# EAGLE design Get_In_Line_REV1 (EAGLE 7.5.0)
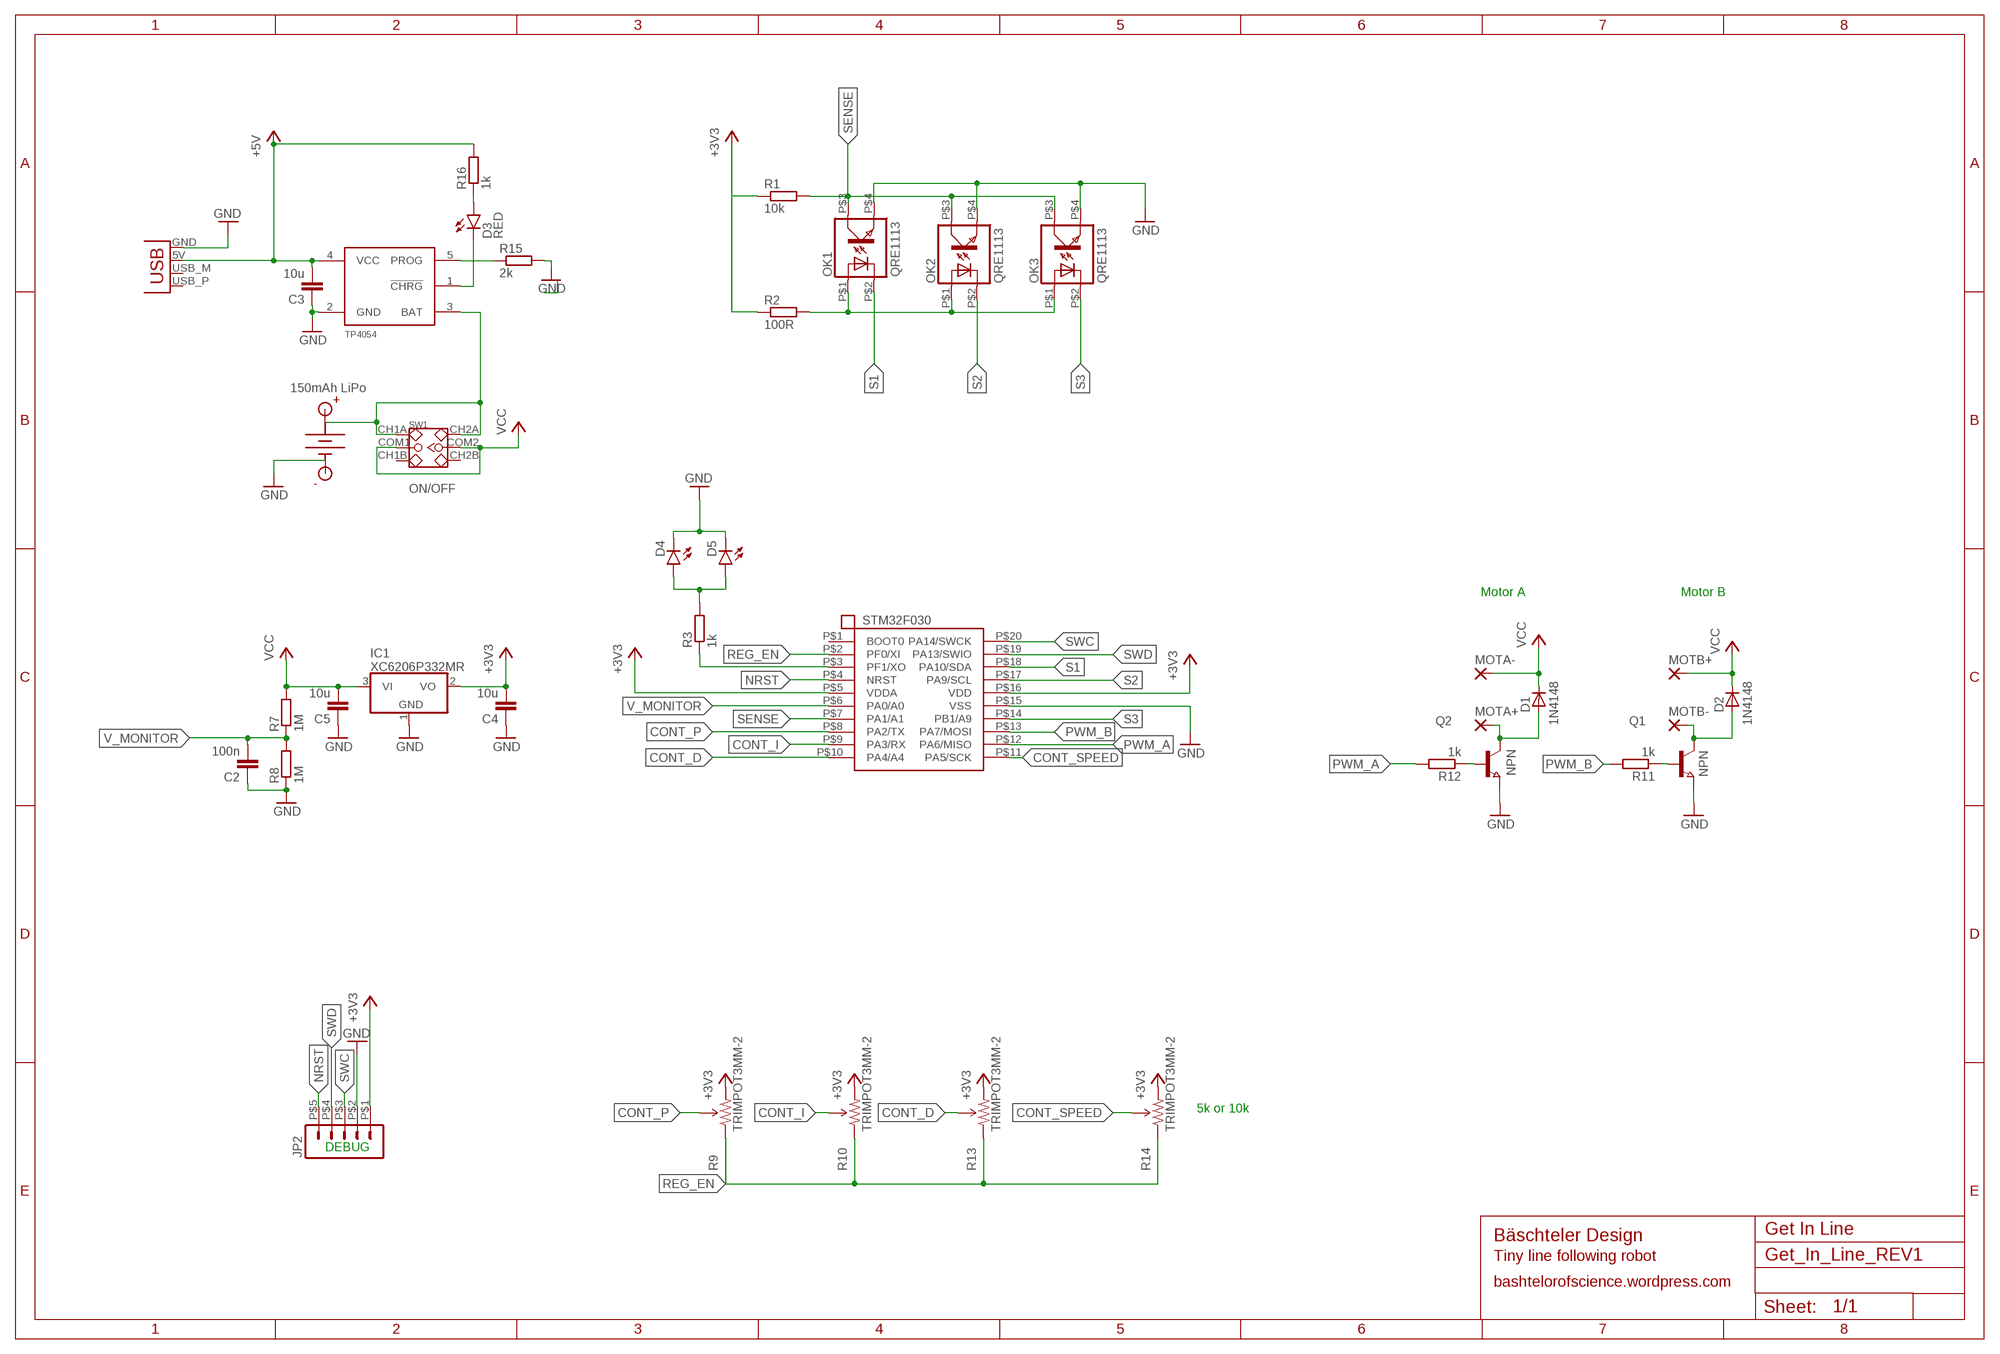
[diagram p0: schematic, sheet 1]

## Parts
C2  100n  C-EUC0805  [C0805]
C3  10u  C-EUC0805  [C0805]
C4  10u  C-EUC0805  [C0805]
C5  10u  C-EUC0805  [C0805]
D1  D-SOD-80  [SOD80]
D2  D-SOD-80  [SOD80]
D3  RED  LED-RED1206  [LED-1206]
D4  GREEN  LED-GREENLARGE  [LED-1206]
D5  GREEN  LED-GREENLARGE  [LED-1206]
IC1  MCP1703CB  [SOT23]
JP1  USBPCB  [USB-A-PCB]
JP2  M05  [SMD_HEADER_5P]
MCU  STM32F030F4P6  [TSSOP-20]
MOTA+  1,6/0,9  [1,6/0,9]
MOTA-  1,6/0,9  [1,6/0,9]
MOTB+  1,6/0,9  [1,6/0,9]
MOTB-  1,6/0,9  [1,6/0,9]
OK1  QRE1113  [DIL04]
OK2  QRE1113  [DIL04]
OK3  QRE1113  [DIL04]
Q1  NPN-TRANSISTOR_SOT23  [SOT23]
Q2  NPN-TRANSISTOR_SOT23  [SOT23]
R1  10k  R-EU_R0805  [R0805]
R2  100R  R-EU_R0805  [R0805]
R3  1k  R-EU_R0805  [R0805]
R7  1M  R-EU_R0805  [R0805]
R8  1M  R-EU_R0805  [R0805]
R9  TRIMPOT3MM-2  [TRIMPOT-3MM-2]
R10  TRIMPOT3MM-2  [TRIMPOT-3MM-2]
R11  1k  R-EU_R0805  [R0805]
R12  1k  R-EU_R0805  [R0805]
R13  TRIMPOT3MM-2  [TRIMPOT-3MM-2]
R14  TRIMPOT3MM-2  [TRIMPOT-3MM-2]
R15  2k  R-EU_R0805  [R0805]
R16  1k  R-EU_R0805  [R0805]
SW1  DIP-TOGGLE-SWITCH-2CH-(2X3P-2.54)  [SW6-2.54-9.0X3.5X3.2+2.0MM]
U$1  TP4054_LIPO_CHARGER  [SOT23-5]
U$5  BATTERY_PAD+1.5MM  [LIPO_BATTERY_PADS_1.5MM]
U$6  BATTERY_PAD-1.5MM  [LIPO_BATTERY_PADS_1.5MM]

## Nets
+3V3: C4.2 IC1.2(VO) JP2.P$1 MCU.P$5(VDDA) MCU.P$16(VDD) R1.1 R2.1 R9.3(CW) R10.3(CW) R13.3(CW) R14.3(CW)
+5V: C3.2 JP1.5V(VBUS) R16.2 U$1.4(VCC)
CONT_D: MCU.P$10(PA4/A4) R13.2(WIPER)
CONT_I: MCU.P$9(PA3/RX) R10.2(WIPER)
CONT_P: MCU.P$8(PA2/TX) R9.2(WIPER)
CONT_SPEED: MCU.P$11(PA5/SCK) R14.2(WIPER)
GND: C2.1 C3.1 C4.1 C5.1 D4.C D5.C IC1.1(GND) JP1.GND JP2.P$2 MCU.P$15(VSS) OK1.P$4(EMIT) OK2.P$4(EMIT) OK3.P$4(EMIT) Q1.2(E) Q2.2(E) R8.1 R15.2 U$1.2(GND) U$6.P$1
LED: MCU.P$3(PF1/XO) R3.1
LEDOUT: D4.A D5.A R3.2
N$1: OK1.P$1(A) OK2.P$1(A) OK3.P$1(A) R2.2
N$5: R15.1 U$1.5(PROG)
N$6: D3.C U$1.1(!CHRG)
N$7: D3.A R16.1
N$9: Q1.1(B) R11.1
N$10: Q2.1(B) R12.1
N$13: D1.2(A) MOTA+.1(P) Q2.3(C)
N$14: D2.2(A) MOTB-.1(P) Q1.3(C)
NRST: JP2.P$5 MCU.P$4(NRST)
PWM_A: MCU.P$12(PA6/MISO) R12.2
PWM_B: MCU.P$13(PA7/MOSI) R11.2
REG_EN: MCU.P$2(PF0/XI) R9.1(CCW) R10.1(CCW) R13.1(CCW) R14.1(CCW)
S1: MCU.P$18(PA10/SDA) OK1.P$2(C)
S2: MCU.P$17(PA9/SCL) OK2.P$2(C)
S3: MCU.P$14(PB1/A9) OK3.P$2(C)
SENSE: MCU.P$7(PA1/A1) OK1.P$3(COL) OK2.P$3(COL) OK3.P$3(COL) R1.2
SWC: JP2.P$3 MCU.P$20(PA14/SWCK)
SWD: JP2.P$4 MCU.P$19(PA13/SWIO)
V_MONITOR: C2.2 MCU.P$6(PA0/A0) R7.1 R8.2
VBAT: SW1.CH1A SW1.CH2A U$1.3(BAT) U$5.P$1
VCC: C5.2 D1.1(C) D2.1(C) IC1.3(VI) MOTA-.1(P) MOTB+.1(P) R7.2 SW1.COM1 SW1.COM2
Unconnected: JP1.USB_M(D-) JP1.USB_P(D+) MCU.P$1(BOOT0) SW1.CH1B SW1.CH2B

## Notes on the sheet
- 150mAh LiPo
- ON/OFF
- Motor A | Motor B
- STM32F030
- XC6206P332MR
- 1N4148 | 1N4148
- NPN | NPN
- 5k or 10k
- DEBUG
- Get In Line
- Bäschteler Design
- Tiny line following robot
- bashtelorofscience.wordpress.com

## Library data of the parts
C2-C5 = resistor:C-EU: CAPACITOR, European symbol
D1 D2 = semicon-smd-ipc:D-: DIODE unfilled
D3 = SparkFun-LED:LED-RED: Assorted Red LEDs LilyPad 1206- DIO-09912 1206- DIO-00809 0603- DIO-00819; PROD_ID: DIO-00809
D4 D5 = SparkFun-LED:LED-GREEN: Various green LEDs Green LEDs used in SFE Production 0603- DIO-00821 LARGE- DIO-00862 LILYPAD- DIO-09910; PROD_ID: DIO-00862
IC1 = linear:MCP1703: 250 mA, 16V, Low Quiescent Current LDO Regulator Source: http://ww1.microchip.com/downloads/en/DeviceDoc/22049b.pdf
JP1 = SparkFun-Connectors:USB: USB Connectors USB-B-PTH is fully proven SKU : PRT-00139/CONN-08278 USB-miniB is fully proven SKU : PRT-00587 USB-A-PCB is untested. USB-A-H is throughly reviewed, but untested. Spark Fun Electronics SKU : PRT-00437 USB-B-SMT is throughly reviewed, but untested. Needs silkscreen touching up. USB-A-S has not been used/tested USB-MB-H has not been used/tested USB-MICROB has been used. CONN-09505
JP2 = smd_pinheader:M05: Header 5 Standard 5-pin 0.1" header. Use with straight break away headers (SKU : PRT-00116), right angle break away headers (PRT-00553), swiss pins (PRT-00743), machine pins (PRT-00117), and female headers (PRT-00115). Molex polarized connector foot print use with SKU : PRT-08230 with associated crimp pins and housings.
MCU = pulseoxparts:STM32F030F4P6
MOTA+ MOTA- MOTB+ MOTB- = wirepad:1,6/0,9: THROUGH-HOLE PAD
OK1-OK3 = fairchild_optosensor:QRE1113: FAIRCHILD REFLECTIVE SENSOR
Q1 Q2 = semicon-smd-ipc:NPN-TRANSISTOR_: NPN TRANSISTOR
R1-R3 R7 R8 R11 R12 R15 R16 = resistor:R-EU_: RESISTOR, European symbol
R9 R10 R13 R14 = SparkFun-Electromechanical:TRIMPOT: Various small potentiometers for "set-and-forget" applications
SW1 = Seeed-Switch-2016:DIP-TOGGLE-SWITCH-2CH-(2X3P-2.54): 311010004; MPN: MS-22D18 G2 ROHS
U$1 = TP4054_lipocharger:TP4054_LIPO_CHARGER
U$5 = LiPo_Battery:BATTERY_PAD+
U$6 = LiPo_Battery:BATTERY_PAD-

## Board
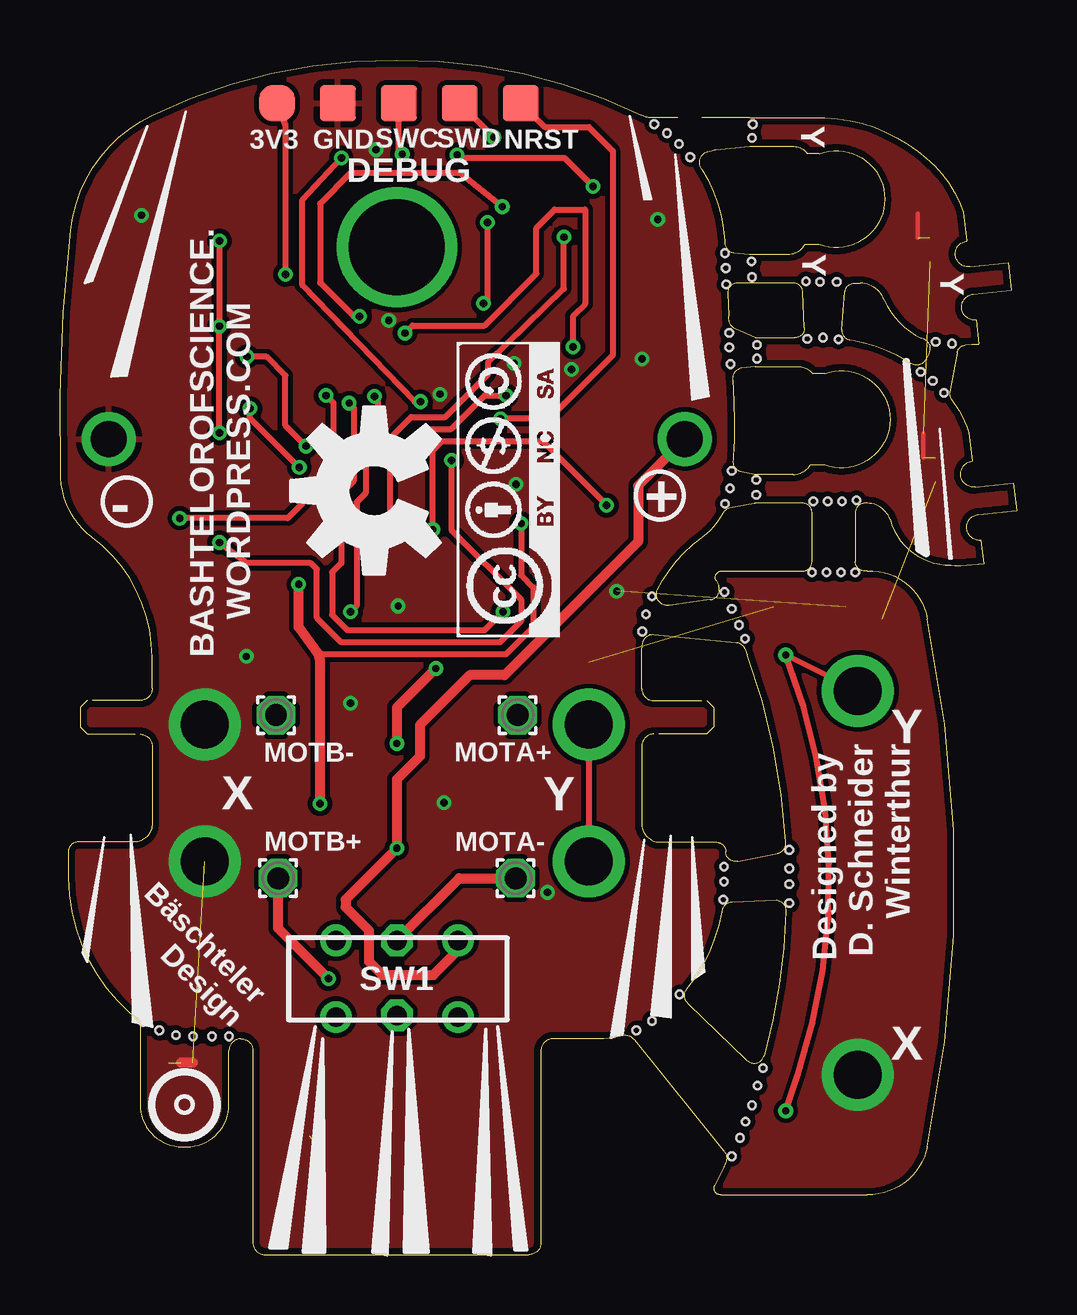
[diagram p1: board, top side]
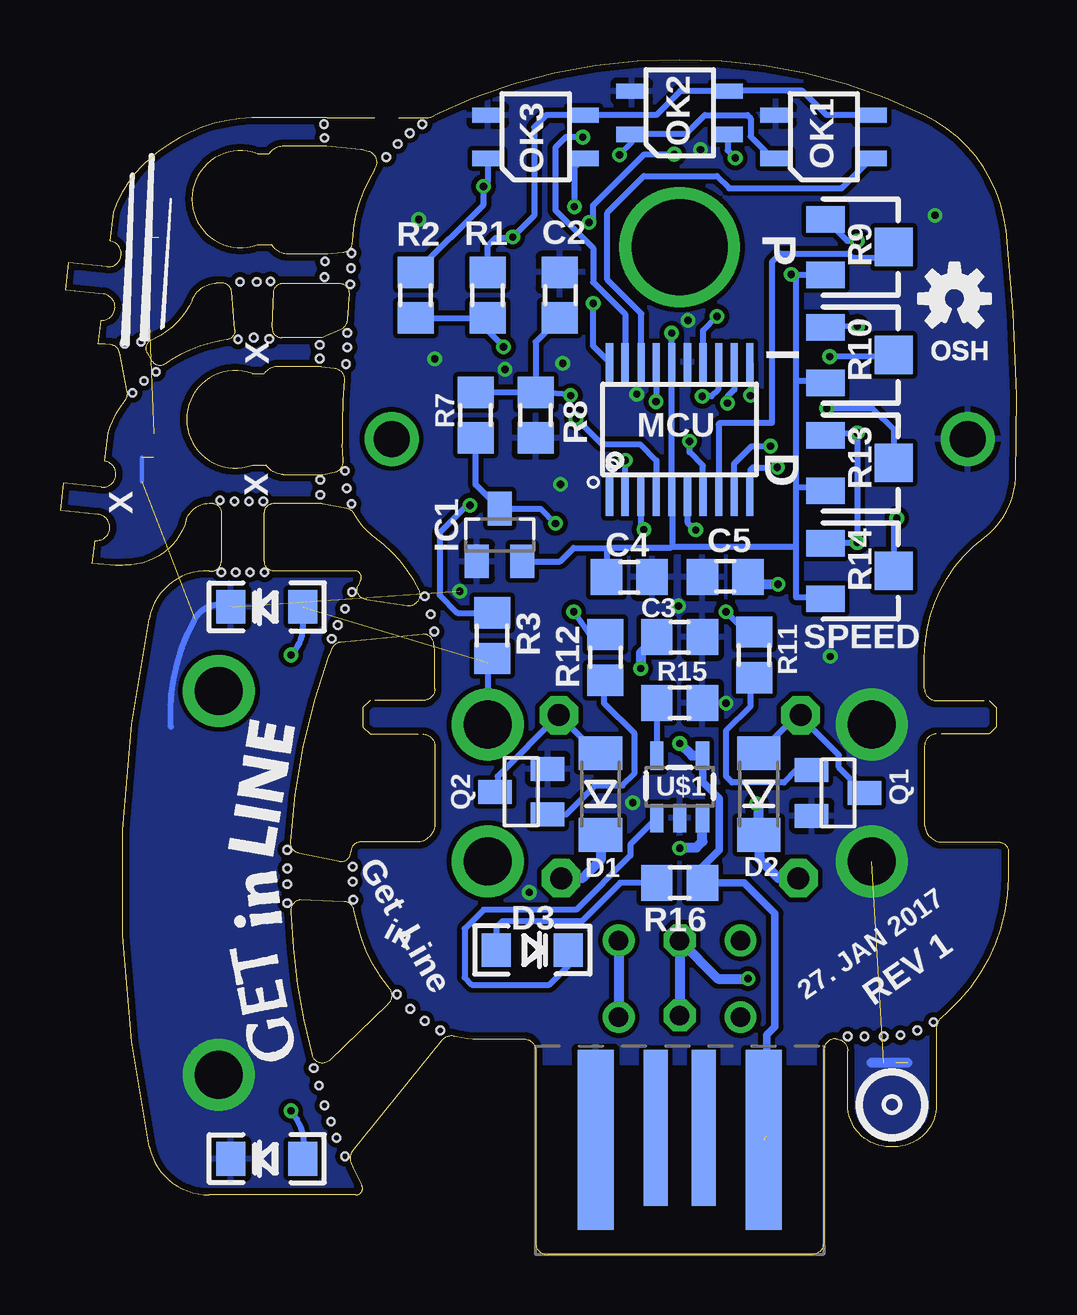
[diagram p2: board, bottom side, seen from below]

Size 39.86 x 49.8 mm. Coordinates in mm from the lower left corner, seen from the top.
Outline: 0.04,32.4 arc51 1.34,29.9 arc-53 3.84,24.9 3.84,23.6 arc-90 3.34,23.1 1.14,23.1 0.84,22.8 0.84,22 1.14,21.7 3.34,21.7 arc-90 3.84,21.2 3.84,17.92 arc-90 3.02,17.2 0.75,17.2 arc90 0.34,16.79 0.34,15.7 arc47 2.89,10.1 3.17,9.85 arc-48 3.34,9.47 3.34,6.25 arc90 5.09,4.5 5.29,4.5 arc90 7.04,6.25 7.04,8.5 arc-90 7.54,9 arc-90 8.04,8.5 8.04,0.5 arc90 8.54,0 19.54,0 arc90 20.04,0.5 20.04,8.5 arc-90 20.54,9 22.44,9 arc16 23.34,9.1 23.43,9.12 arc-65 23.94,8.95 27.67,4.3 arc-61 27.74,3.86 27.64,3.6 27.29,2.9 arc127 27.54,2.5 33.64,2.5 arc79 36.14,4.5 arc24 36.14,26.5 arc83 33.64,28.5 33.54,28.5 arc-90 33.14,28.9 33.14,30.93 arc-90 33.54,31.32 33.64,31.32 arc-69 34.59,30.65 arc76 37.14,28.75 arc8 37.54,28.73 38.51,28.8 38.39,29.77 arc-180 38.27,30.86 39.86,31.02 39.72,32.16 38.13,32 arc-180 38.01,33.08 37.86,34.27 arc17 37.44,35.2 37.13,35.66 arc-44 37.07,35.96 37.38,37.6 arc-74 37.74,37.93 37.99,37.95 38.29,37.95 38.17,38.96 arc-180 38.05,40.04 39.64,40.2 39.5,41.34 37.91,41.18 arc-180 37.79,42.26 37.64,43.46 arc35 35.74,46 arc15 33.94,47 arc22 31.34,47.4 28.74,47.4 24.56,47.4 arc-33 24.24,47.5 arc27 14.04,49.8
Outline: 0.04,32.4 arc-9 0.44,42.7
Outline: 0.44,42.7 arc-57 3.84,47.5
Outline: 3.84,47.5 arc-27 14.04,49.8
Outline: 28.64,25 28.54,25.26 arc63 28.18,25.52 24.74,25.86 arc88 24.29,25.5 arc13 24.24,24.9 24.24,23.6 arc90 24.74,23.1 26.94,23.1 27.24,22.8 27.24,22 26.94,21.7 24.74,21.7 arc90 24.24,21.2 24.24,17.92 arc90 25.06,17.2 27.33,17.2 arc-90 27.74,16.8 arc101 28.23,16.4 29.9,16.73
Outline: 29.9,16.73 arc79 30.24,17.15
Outline: 29.84,14.79 28.01,14.71 arc74 27.61,14.39 27.59,14.3 arc-29 26.14,11.1 26.11,11.06 arc87 26.19,10.46 28.62,8.11 arc118 29.34,8.3
Outline: 29.84,14.79 arc-92 30.24,14.3
Outline: 30.24,14.3 arc-14 29.34,8.3
Outline: 30.24,17.2 arc17 28.64,25
Outline: 29.9,16.73 arc79 30.24,17.15
Outline: 29.84,14.79 arc-92 30.24,14.3
Outline: 30.24,14.3 arc-14 29.34,8.3
Outline: 30.24,17.2 arc17 28.64,25
Outline: 29.9,16.73 arc79 30.24,17.15
Outline: 30.24,17.15 30.24,17.2
Outline: 29.84,14.79 arc-92 30.24,14.3
Outline: 30.24,14.3 arc-14 29.34,8.3
Outline: 30.24,17.2 arc17 28.64,25
Outline: 0.04,32.4 arc-9 0.44,42.7
Outline: 0.44,42.7 arc-57 3.84,47.5
Outline: 0.04,32.4 arc-9 0.44,42.7
Outline: 0.44,42.7 arc-57 3.84,47.5
Outline: 3.84,47.5 arc-27 14.04,49.8
Outline: 0.04,32.4 arc-9 0.44,42.7
Outline: 0.44,42.7 arc-57 3.84,47.5
Outline: 0.04,32.4 arc-9 0.44,42.7
Outline: 0.44,42.7 arc-57 3.84,47.5
Outline: 3.84,47.5 arc-27 14.04,49.8
Outline: 0.04,32.4 arc-9 0.44,42.7
Outline: 0.44,42.7 arc-57 3.84,47.5
Outline: 0.04,32.4 arc-9 0.44,42.7
Outline: 0.44,42.7 arc-57 3.84,47.5
Outline: 3.84,47.5 arc-27 14.04,49.8
Outline: 0.04,32.4 arc-9 0.44,42.7
Outline: 0.44,42.7 arc-57 3.84,47.5
Outline: 27.54,28.5 30.94,28.5 arc90 31.34,28.9 31.34,30.93 arc90 30.94,31.32 28.99,31.32 arc11 28.92,31.31 27.91,31.11 arc49 27.61,30.9 27.51,30.73 arc-21 26.74,29.9 arc27 24.89,27.7 arc120 25.39,27.06 27.09,27.3 arc110 27.44,27.9 27.34,28.1 arc-113 27.54,28.5
Outline: 28.96,37.02 30.76,37.02 arc-56 31.36,36.72 31.86,36.72 arc-220 31.86,32.92 31.26,32.92 arc-56 30.56,32.52 29,32.52 arc-11 28.92,32.53 28.41,32.63 arc-82 28.06,33.08 28.06,33.12 28.09,33.8 arc5 28.02,36.47 arc-87 28.41,36.95 28.96,37.02
Outline: 28.74,46.2 30.54,46.2 arc-56 31.14,45.9 31.64,45.9 arc-220 31.64,42.1 31.04,42.1 arc-56 30.34,41.7 28.76,41.7 arc-6 28.72,41.7 28.08,41.77 arc-78 27.7,42.14 27.69,42.25 arc30 26.74,45.25 arc-111 26.99,45.98 27.16,46.03 arc-10 27.32,46.06 28.74,46.2
Outline: 34.34,39.8 arc69 33.34,40.5 33.11,40.5 arc85 32.71,40.13 32.57,38.57 arc86 32.9,38.14 33.14,38.1 arc-19 35.24,37.3 35.47,37.14 arc95 36.05,37.28 36.22,37.59 arc99 36,38.16 35.89,38.2 arc-40 34.34,39.8
Outline: 30.56,40.5 28.24,40.5 arc93 27.82,40.05 27.84,39.65 27.86,39.12 27.87,38.99 arc63 28.15,38.58 28.96,38.23 30.62,38.23 arc93 31.02,38.64 30.96,40.12 arc87 30.56,40.5
Copper layers (1*16): Top 0.035mm / dielectric 1.5mm / Bottom 0.035mm
Design rules "dirt_cheap_dirty_boards.v1": minimum track width 5mil, minimum drill 12mil, track to track 5mil, track to pad 5mil, pad to pad 5mil, via to via 5mil, smd to smd 0mil, copper to edge 10mil, drill to drill 10mil, minimum pad ring 10mil, minimum via ring 6mil, stop-mask expansion 2mil, vias tented up to drill 25mil, thermal gap 10mil
Holes 0.3 mm at 27.66,16.18 27.66,15.55 27.64,14.8 24.01,9.35 24.66,9.75 25.26,10.25 25.81,10.85 29.29,7.78 29.06,7.05 28.84,6.22 28.56,5.55 28.34,4.88 27.99,4.1 30.39,16.88 30.39,16.1 30.39,15.45 30.39,14.65 24.66,27.45 24.41,26.7 24.26,25.98 27.69,27.62 27.99,26.93 28.29,26.25 28.54,25.68 27.71,31.3 27.91,31.95 27.99,32.67 29.01,32.3 29.01,31.68 27.89,38.42 27.89,37.83 27.94,37.12 29.04,37.92 29.04,37.35 35.86,36.8 36.36,36.42 36.84,35.92 36.49,38.05 37.16,37.98 32.44,38.15 31.79,38.23 31.14,38.17 31.09,40.58 31.66,40.55 32.36,40.55 27.71,41.75 27.74,41.12 27.76,40.45 28.81,41.4 28.84,40.75 28.86,47.12 28.84,46.55 24.76,47.12 25.29,46.75 25.79,46.3 26.26,45.75 31.39,31.4 31.99,31.4 32.59,31.4 33.19,31.45 31.34,28.45 31.94,28.45 32.54,28.45 33.14,28.45 3.46,9.7 7.04,9.1 6.34,9.1 5.54,9.1 4.84,9.15 4.14,9.35

### Footprints (pad centres in the part's own frame; a part is rotated, then mirrored left to right if it is on the bottom)
C0805 = smd 1.3 x 1.5: 1 -0.95,0; 2 0.95,0
SOD80 = smd 1.4 x 1.8: 1 -1.7,0; 2 1.7,0
LED-1206 = smd 1.2 x 1.4: A -1.5,0; C 1.5,0
SOT23 = smd 1 x 1.4: 1 -0.95,-1.1; 2 0.95,-1.1; 3 0,1.1
USB-A-PCB = smd 7.5 x 1.5: 5V -0.2,-3.5; GND -0.2,3.5 | smd 6.5 x 1: USB_M 0.3,-1; USB_P 0.3,1
SMD_HEADER_5P = smd 1.5 x 1.5: P$1 0,0; P$2 2.54,0; P$3 5.08,0; P$4 7.62,0; P$5 10.16,0
TSSOP-20 = smd 1.6 x 0.3: P$1 -2.8,2.925; P$2 -2.8,2.275; P$3 -2.8,1.625; P$4 -2.8,0.975; P$5 -2.8,0.325; P$6 -2.8,-0.325; P$7 -2.8,-0.975; P$8 -2.8,-1.625; P$9 -2.8,-2.275; P$10 -2.8,-2.925; P$11 2.8,-2.925; P$12 2.8,-2.275; P$13 2.8,-1.625; P$14 2.8,-0.975; P$15 2.8,-0.325; P$16 2.8,0.325; P$17 2.8,0.975; P$18 2.8,1.6; P$19 2.8,2.275; P$20 2.8,2.925
1,6/0,9 = drill 0.914 pad 1.6 octagon: 1 0,0
DIL04 = smd 0.635 x 1.27: P$1 0.3,-2; P$2 0.3,2; P$3 -1.5,2; P$4 -1.5,-2
R0805 = smd 1.3 x 1.5: 1 -0.95,0; 2 0.95,0
TRIMPOT-3MM-2 = smd 1.092 x 1.6: 1 -1.155,-1.421; 3 1.155,-1.421 | smd 1.6 x 1.6: 2 0,1.421
SW6-2.54-9.0X3.5X3.2+2.0MM = drill 0.813 pad 1.27: CH1A -2.54,-1.6; CH1B 2.54,-1.6; CH2A -2.54,1.6; CH2B 2.54,1.6 | drill 0.813 pad 1.27 octagon: COM1 0,-1.6; COM2 0,1.524
SOT23-5 = smd 0.55 x 1.2: 1 -0.95,-1.3; 2 0,-1.3; 3 0.95,-1.3; 4 0.95,1.3; 5 -0.95,1.3
LIPO_BATTERY_PADS_1.5MM = drill 1.5: P$1 0,0

### Placement (x,y rotation side)
C2  19.04,40 270 bottom
C3  14.04,25.75 180 bottom
C4  16.14,28.25 180 bottom
C5  12.14,28.25 0 bottom
D1  17.34,19.2 90 bottom
D2  10.74,19.2 90 bottom
D3  20.18,12.7 0 bottom
D4  31.24,27 180 bottom
D5  31.24,4 180 bottom
IC1  21.54,30 0 bottom
JP1  14.04,5 90 bottom
JP2  9.04,48 0 top
MCU  14.04,34.4 90 bottom
MOTA+  19.07,22.49 0 top
MOTA-  18.98,15.69 0 top
MOTB+  9.09,15.69 0 top
MOTB-  9,22.49 0 top
OK1  8.04,46 270 bottom
OK2  14.04,47 270 bottom
OK3  20.04,46 270 bottom
Q1  7.44,19.25 270 bottom
Q2  20.64,19.3 90 bottom
R1  22.04,40 90 bottom
R2  25.04,40 90 bottom
R3  21.86,25.81 270 bottom
R7  22.54,35 270 bottom
R8  20.04,35 90 bottom
R9  6.54,42 270 bottom
R10  6.54,37.5 270 bottom
R11  10.94,25 90 bottom
R12  17.14,24.9 90 bottom
R13  6.54,33 270 bottom
R14  6.54,28.5 270 bottom
R15  14.04,23 0 bottom
R16  14.04,15.5 0 bottom
SW1  14.04,11.5 180 top
U$1  14.04,19.5 0 bottom
U$2  [OSHW-LOGO-S]  2.59,39.85 0 bottom
U$4  [CC-BY-NC-SA]  20.81,25.76 90 top
U$5  26.04,34 0 top
U$6  2.04,34 0 top
U$8  [OSHW-LOGO-S]  2.59,39.85 0 bottom
U$9  [OSHW-LOGO-S]  2.59,39.85 0 bottom
U$10  [OSHW-LOGO-S]  2.59,39.85 0 bottom
U$13  [OSHW-LOGO-S]  2.59,39.85 0 bottom
U$14  [OSHW-LOGO-S]  2.59,39.85 0 bottom
U$15  [OSHW-LOGO-S]  2.59,39.85 0 bottom
U$16  [OSHW-LOGO-S]  2.59,39.85 0 bottom
U$33  [OSHW-LOGO-L]  13.09,31.85 90 top

### Tracks (layer width: path | path; a pad name or v marks a point on that pad's centre or on a via)
+3V3  (via drill 0.3)
  Top 0.254: v14.37,38.41 14.69,38.73 17.69,38.73 19.85,40.89 19.85,42.8 20.61,43.56 21.88,43.56 21.88,39.62 21.37,39.12 v21.37,37.85 | JP2.P$1 9.38,47.09 v9.39,40.87
  Bottom 0.254: v14.37,38.41 14.36,38.2 MCU.P$16 MCU.P$5 14.36,29.52 | C4.2 17.06,28.03 17.06,29.46 | R13.3 8.09,31.97 9.18,31.97 | 9.18,31.97 9.18,36.42 | 9.18,36.42 9.18,40.86 | 9.18,40.86 9.17,40.84 R9.3 | R10.3 8.03,36.42 9.18,36.42 | R14.3 8.01,27.4 9.18,27.4 9.18,29.54 | 9.18,29.54 9.18,31.97 | 17.06,29.46 14.41,29.46 14.36,29.52 | IC1.2 19.02,28.9 18.45,29.46 17.06,29.46 | v9.39,40.87 v9.39,40.86 9.18,40.86 | v21.37,37.85 22.04,38.51 R1.1 R2.1 | 14.36,29.52 9.21,29.52 9.18,29.54
+5V  (via drill 0.3)  (1 unrouted)
  Top 0.406: v15.66,24.43 14.03,22.81 v14.03,21.31
  Bottom 0.305: U$1.4 13.07,20.78 13.07,19.71 12.38,19.02 12.38,16.87 13.09,16.16 R16.2 11.35,15.5 10.07,14.22 10.07,9.5 10.4,9.17 10.4,4.94
  Bottom 0.406: C3.2 15.66,25.08 v15.66,24.43 | v14.03,21.31 13.52,20.8 U$1.4
CONT_D  (via drill 0.3)
  Top 0.254: v9.97,32.82 7.91,34.87 v7.91,35.27
  Bottom 0.254: R13.2 5.12,34.38 6.01,35.27 v7.91,35.27 | MCU.P$10 11.09,31.63 11.09,32.72 10.99,32.82 v9.97,32.82
CONT_I  (via drill 0.3)
  Top 0.254: v10.25,33.71 9.39,34.57 9.39,36.65 8.6,37.43 v7.79,37.43
  Bottom 0.254: R10.2 5.18,37.43 v7.79,37.43 | MCU.P$9 11.77,31.61 11.77,32.97 11.04,33.71 v10.25,33.71
CONT_P
  Bottom 0.254: MCU.P$8 12.41,34.62 12.36,34.67 10.2,34.67 10.2,41.38 9.84,41.73 7.02,41.73 6.85,41.55 5.56,41.55 R9.2
CONT_SPEED  (via drill 0.3)
  Top 0.254: v11.09,35.81 11.39,35.51 11.39,32.61 9.48,30.7 v4.99,30.7
  Bottom 0.254: MCU.P$11 11.09,37.17 v11.09,35.81 | v4.99,30.7 5.12,30.58 R14.2
GND  (via drill 0.3, 2)  (7 unrouted)
  Top 0.178: 35.96,34.22 35.96,33.22 | 35.74,43.4 35.74,42.4
  Top 0.406: 5.54,8 5.04,8
  Bottom 0.178: 36.46,32.22 36.46,33.22 | 36.24,41.4 36.24,42.4
  Bottom 0.254: 35.24,22 arc32 34.24,26.5 arc86 D4.C
  Bottom 0.406: 4.54,8 6.04,8
  other vias: 13.7,38.95 12.1,22.99 6.04,22.1 6.04,16.4 20.31,15.1 24.91,43.15 33.24,7.5 18.91,37.16 24.24,37.34 21.32,36.91 19,32.11 23.2,27.66 14.09,27.04 13.17,46.06 15.83,35.87 3.4,43.33 7.76,24.94 15.99,18.84
  pour Bottom (isolate 0.2): 0.04,50 0.04,8 3.04,8 3.04,4.5 7.04,4.5 7.04,8 26.04,8 26.04,2 41.04,2 41.04,50
  pour Top (isolate 0.2): 0.04,50 0.04,0 41.04,0 41.04,50
LED  (via drill 0.3)
  Top 0.254: v15.53,30.23 15.53,33.53 15.91,33.91 20.1,33.91 v22.77,31.24
  Bottom 0.254: MCU.P$3 15.66,30.36 v15.53,30.23 | v22.77,31.24 22.9,31.24 24.04,30.1 24.04,27.5 23.3,26.76 R3.1
LEDOUT  (via drill 0.3, 2)  (1 unrouted)
  Top 0.254: v30.24,6 30.74,7.5 arc40 v30.24,25 v33.24,23.5 | v22.04,22.1 v22.04,16.4
  Bottom 0.254: v30.24,25 arc-74 29.92,26.96 arc21 D4.A | D5.A arc-53 v30.24,6 | R3.2 22.04,24.68 v22.04,22.1
N$1  (via drill 0.3)
  Top 0.254: v16.55,45.85 16.68,45.72 21.02,45.72 v22.21,44.53 22.04,44.7
  Bottom 0.254: v16.55,45.85 16.04,46.36 OK2.P$1 16,46.74 13.75,46.74 12.99,47.5 11.21,47.5 11.09,47.37 11.09,46.61 10.18,45.7 OK1.P$1 | R2.2 22.21,43.78 v22.21,44.53 22.04,44.7 OK3.P$1
N$5
  Bottom 0.254: R15.1 14.99,22.9 U$1.5
N$6
  Bottom 0.254: U$1.1 16.09,17.1 16.09,16.64 18.35,14.38 22.21,14.38 23,13.59 23,11.56 22.7,11.25 19.47,11.25 18.68,12.04 D3.C
N$7
  Bottom 0.254: R16.1 16.52,15.5 18.12,13.89 21.43,13.89 21.68,13.64 D3.A
N$8  (via drill 4)
  other vias: 14.04,42
N$9
  Bottom 0.254: Q1.1 9.18,20.2 9.69,19.68 11.85,19.68 12.1,19.94 12.1,21.84 11.09,22.86 11.09,24 R11.1
N$10
  Bottom 0.254: Q2.1 18.77,18.35 17.56,19.56 16.42,19.56 15.91,20.07 15.91,21.72 17.18,22.99 17.18,24 R12.1
N$13
  Bottom 0.254: Q2.3 21.63,19.41 21.63,19.94 MOTA+.1 17.48,20.9 D1.2
N$14
  Bottom 0.254: Q1.3 7.4,20.32 7.4,20.83 9,22.42 MOTB-.1 9.14,22.49 D2.2
NRST  (via drill 0.3)
  Top 0.254: JP2.P$5 20.2,47 22.04,47 23.04,46 23.04,37.5 20.39,34.85 v18.35,34.85
  Bottom 0.254: v18.35,34.85 17.29,33.78 15.68,33.78 15.01,33.11 MCU.P$4
PWM_A  (via drill 0.3)
  Top 0.254: v12.05,35.5 12.23,35.32 12.23,32.26 11.72,31.75 11.72,28.83 11.34,28.45 11.34,26.67 11.98,26.04 17.69,26.04 v18.45,26.8
  Bottom 0.254: MCU.P$12 11.76,36.06 12.05,35.77 v12.05,35.5 | v18.45,26.8 17.72,25.75 R12.2
PWM_B  (via drill 0.3)
  Top 0.254: v13.1,35.78 13.25,35.63 13.25,34.8 12.74,34.29 12.74,31.75 12.36,31.37 12.36,27.05 v12.1,26.8
  Bottom 0.254: MCU.P$13 12.44,37.17 12.44,36.06 12.72,35.78 v13.1,35.78 | v12.1,26.8 11.16,25.85 R11.2
REG_EN  (via drill 0.3)
  Top 0.254: v6.64,42.26 v6.64,38.7 v6.64,34.26 | v16.31,33.11 16.31,30.21 19.22,27.3 19.22,26.42 18.33,25.53 11.72,25.53 10.71,26.54 10.71,28.57 10.45,28.83 7.79,28.83 v6.64,29.69
  Bottom 0.254: R9.1 7.06,42.26 v6.64,42.26 | v6.64,38.7 7.86,38.66 R10.1 | R13.1 7.86,34.26 v6.64,34.26 v6.64,29.69 7.93,29.69 R14.1 | MCU.P$2 v16.31,33.11
S1
  Bottom 0.254: MCU.P$18 15.64,39.22 17.06,40.64 17.06,43.43 15.53,44.96 12.48,44.96 11.98,44.45 7.29,44.45 OK1.P$2
S2  (via drill 0.3)
  Top 0.254: v15.02,35.56 14.77,35.56 10.1,40.41 10.1,43.97 v11.72,45.72
  Bottom 0.254: MCU.P$17 15.01,35.57 v15.02,35.56 | OK2.P$2 12.04,46.04 v11.72,45.72
S3  (via drill 0.3)
  Top 0.254: v18.43,43.69 16.68,45.09 12.1,45.09 10.83,43.81 10.83,40.51 12.23,39.12 v12.48,39.12
  Bottom 0.254: MCU.P$14 13.06,38.54 v12.48,39.12 | OK3.P$2 18.43,45.31 v18.43,43.69
SENSE  (via drill 0.3)
  Top 0.254: v13.63,33.91 14.64,34.92 16.06,34.92 17.84,36.7 17.84,37.2 20.99,40.26 v20.99,42.42
  Bottom 0.254: MCU.P$7 13.07,32.89 13.63,33.45 v13.63,33.91 | OK1.P$3 7.91,47.5 8.93,48.51 12.02,48.51 OK2.P$3 14.02,48.5 15.02,47.5 OK3.P$3 19.59,47.5 20.1,46.99 20.1,43.31 v20.99,42.42 21.02,42.39 21.7,42.39 22.04,42.06 R1.2
SWC  (via drill 0.3)
  Top 0.254: v17.64,39.65 17.82,39.83 v17.82,43.03 | v14.26,45.87 14.12,46.02 JP2.P$3
  Bottom 0.254: MCU.P$20 17.64,37.88 v17.64,39.65 | v17.82,43.03 17.64,43.2 17.64,43.74 15.51,45.87 v14.26,45.87
SWD  (via drill 0.3)
  Top 0.254: JP2.P$4 v18.07,46.58
  Bottom 0.254: MCU.P$19 16.31,39.21 17.64,40.54 17.64,41.96 19.22,43.54 19.22,46.15 18.78,46.58 v18.07,46.58
V_MONITOR  (via drill 0.3)
  Top 0.254: v13.37,30.21 13.75,30.6 13.75,32.89 15.28,34.42 16.29,34.42 17.69,35.81 v18.58,35.81
  Bottom 0.254: C2.2 20.04,38.05 R8.2 | R7.1 R8.2 | MCU.P$6 13.72,30.52 13.41,30.21 v13.37,30.21 | v18.58,35.81 18.62,35.85 R8.2
VBAT  (via drill 0.3)
  Top 0.406: U$5.P$1 24.09,32.05 24.09,29.72 18.53,24.16 17.08,24.16 15,22.07 15,20.78 14.03,19.81 v14.03,16.94 11.9,14.81 11.9,14.48 12.87,13.51 12.87,12.22 13.42,11.66 15.56,11.66 16.58,12.68 SW1.CH1A
  Bottom 0.406: SW1.CH1A SW1.CH2A | v14.03,16.94 14.01,16.97 13.35,16.97 13.09,17.23 U$1.3
VCC  (via drill 0.3)
  Top 0.254: v19.22,30.48 19.22,28.32 19.72,27.81 19.72,26.16 18.58,25.02 10.79,25.02
  Top 0.406: v9.94,27.94 9.94,26.16 10.79,25.02 10.83,24.77 v10.83,18.8 | SW1.COM1 16.63,15.69 MOTA-.1 | v11.19,11.51 9.09,13.61 MOTB+.1
  Bottom 0.254: R7.2 22.54,32.1 IC1.3 19.84,31.1 v19.22,30.48 | 10.74,18.7 v10.83,18.8 | 11.13,27.94 C5.2
  Bottom 0.406: SW1.COM2 SW1.COM1 12.44,11.51 v11.19,11.51 | 10.74,18.7 D2.1 10.71,17.47 10.71,16.48 9.92,15.69 MOTB+.1 | v9.94,27.94 11.13,27.94 | D1.1 17.34,16.46 18.1,15.69 MOTA-.1

### Text on the board
tNames: Y | 3V3 | GND | SWC | SWD | NRST | DEBUG | Y | Y | + | - | BASHTELOROFSCIENCE. / WORDPRESS.COM | Designed by / D. Schneider / Winterthur | Y | X | Y | Bäschteler | Design | X
bNames: P | I | X | OSH | OSH | OSH | OSH | OSH | OSH | OSH | OSH | D | X | X | SPEED | Get Line | in | 27. JAN 2017 | REV 1